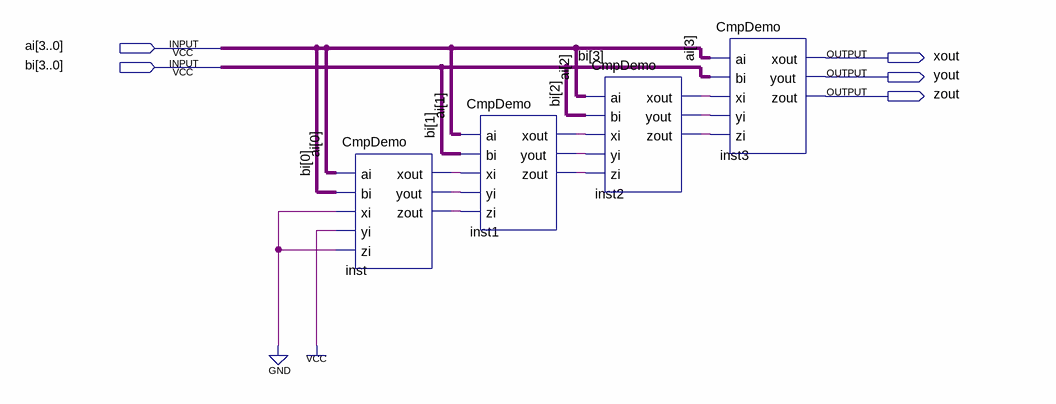
[diagram p0: schematic sheet]
// Quartus schematic Cmp4Demo.bdf as structural Verilog: 4 symbols, 5 pins
module Cmp4Demo (
  input  [3:0] ai,
  input  [3:0] bi,
  output xout,
  output yout,
  output zout
);

  wire inst1_xout, inst1_yout, inst1_zout, inst2_xout, inst2_yout, inst2_zout, inst_xout, inst_yout,
       inst_zout;

  CmpDemo inst (
    .ai(ai[0]), .bi(bi[0]), .xi(1'b0), .yi(1'b1), .zi(1'b0), .xout(inst_xout), .yout(inst_yout),
    .zout(inst_zout));
  CmpDemo inst1 (
    .ai(ai[1]), .bi(bi[1]), .xi(inst_xout), .yi(inst_yout), .zi(inst_zout), .xout(inst1_xout),
    .yout(inst1_yout), .zout(inst1_zout));
  CmpDemo inst2 (
    .ai(ai[2]), .bi(bi[2]), .xi(inst1_xout), .yi(inst1_yout), .zi(inst1_zout), .xout(inst2_xout),
    .yout(inst2_yout), .zout(inst2_zout));
  CmpDemo inst3 (
    .ai(ai[3]), .bi(bi[3]), .xi(inst2_xout), .yi(inst2_yout), .zi(inst2_zout), .xout(xout), .yout(yout),
    .zout(zout));
endmodule
